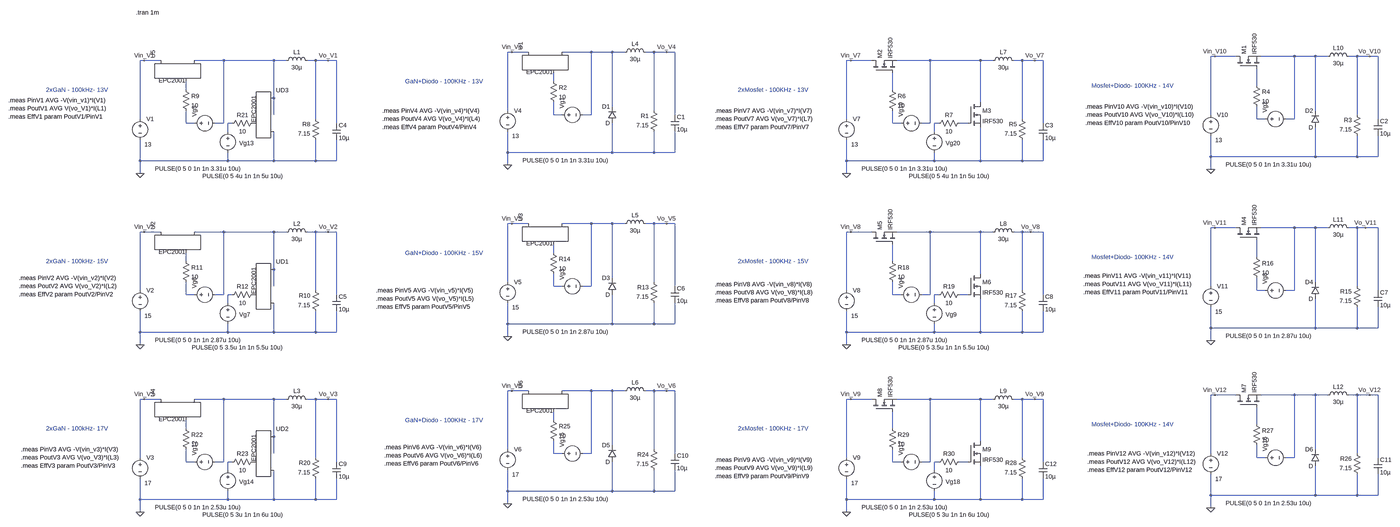
[diagram p0: schematic Variação Tensao.asc, whole sheet]
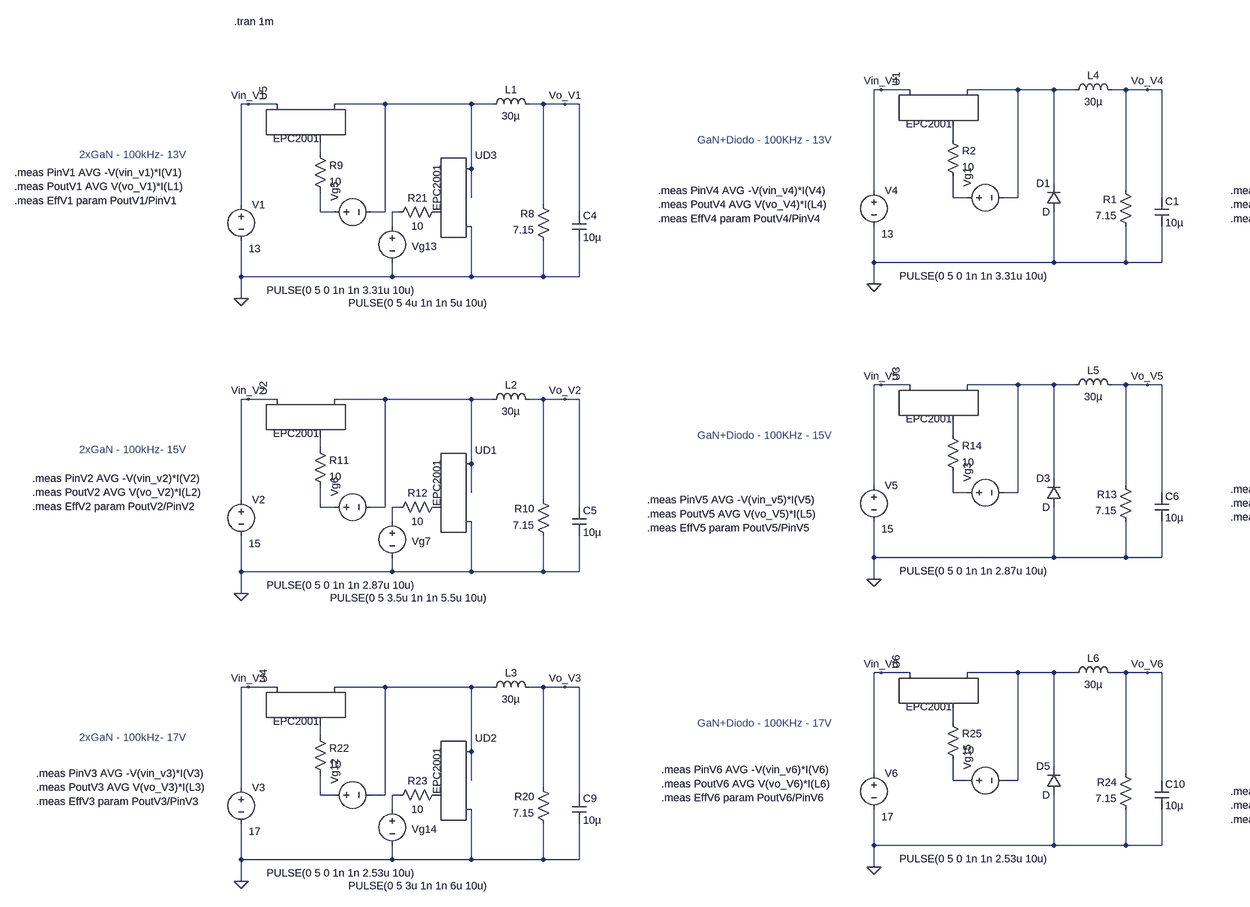
[diagram p1: schematic Variação Tensao.asc, part, row 1 of 1, column 1 of 2]
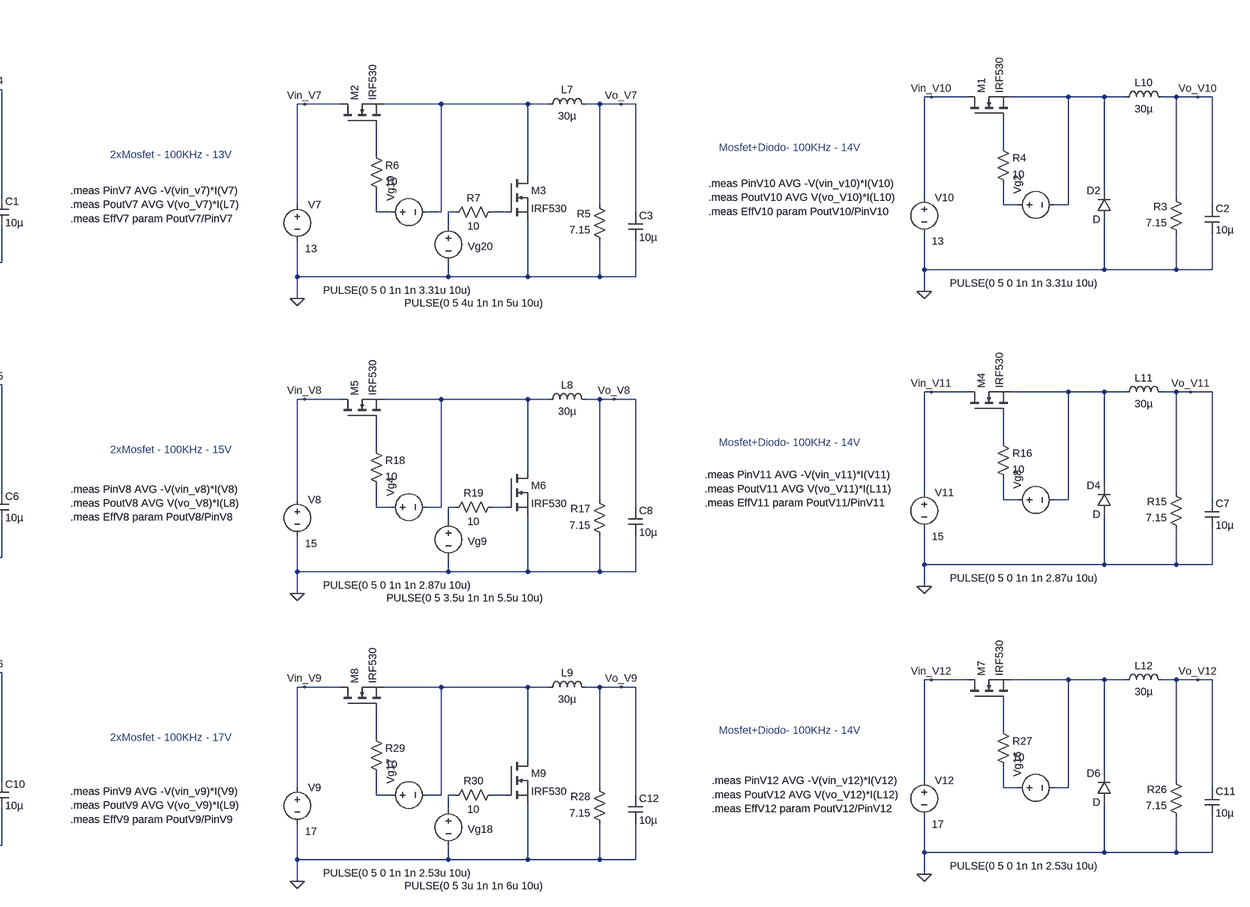
[diagram p2: schematic Variação Tensao.asc, part, row 1 of 1, column 2 of 2]
Variação Tensao.asc, the LTspice schematic file:
Version 4
SHEET 1 6056 2684
WIRE 2096 896 2080 896
WIRE 2160 896 2096 896
WIRE 2400 896 2288 896
WIRE 2480 896 2400 896
WIRE 2528 896 2480 896
WIRE 2640 896 2608 896
WIRE 2688 896 2640 896
WIRE 2720 896 2688 896
WIRE 5040 912 5024 912
WIRE 5120 912 5040 912
WIRE 5344 912 5216 912
WIRE 5424 912 5344 912
WIRE 5472 912 5424 912
WIRE 5584 912 5552 912
WIRE 5632 912 5584 912
WIRE 5664 912 5632 912
WIRE 656 928 640 928
WIRE 720 928 656 928
WIRE 960 928 848 928
WIRE 1152 928 960 928
WIRE 1200 928 1152 928
WIRE 1312 928 1280 928
WIRE 1360 928 1312 928
WIRE 1392 928 1360 928
WIRE 3488 928 3472 928
WIRE 3568 928 3488 928
WIRE 3792 928 3664 928
WIRE 3984 928 3792 928
WIRE 4032 928 3984 928
WIRE 4144 928 4112 928
WIRE 4192 928 4144 928
WIRE 4224 928 4192 928
WIRE 2256 1008 2256 976
WIRE 5200 1024 5200 960
WIRE 816 1040 816 1008
WIRE 3648 1040 3648 976
WIRE 1152 1072 1152 928
WIRE 3984 1088 3984 928
WIRE 2480 1104 2480 896
WIRE 2080 1120 2080 896
WIRE 2640 1120 2640 896
WIRE 5424 1120 5424 912
WIRE 1152 1136 1152 1072
WIRE 2256 1136 2256 1088
WIRE 2288 1136 2256 1136
WIRE 2400 1136 2400 896
WIRE 2400 1136 2368 1136
WIRE 2720 1136 2720 896
WIRE 5024 1136 5024 912
WIRE 5584 1136 5584 912
WIRE 640 1152 640 928
WIRE 1312 1152 1312 928
WIRE 3472 1152 3472 928
WIRE 4144 1152 4144 928
WIRE 5200 1152 5200 1104
WIRE 5232 1152 5200 1152
WIRE 5344 1152 5344 912
WIRE 5344 1152 5312 1152
WIRE 5664 1152 5664 912
WIRE 816 1168 816 1120
WIRE 848 1168 816 1168
WIRE 960 1168 960 928
WIRE 960 1168 928 1168
WIRE 992 1168 976 1168
WIRE 1392 1168 1392 928
WIRE 3648 1168 3648 1120
WIRE 3680 1168 3648 1168
WIRE 3792 1168 3792 928
WIRE 3792 1168 3760 1168
WIRE 3824 1168 3808 1168
WIRE 3936 1168 3904 1168
WIRE 4224 1168 4224 928
WIRE 976 1200 976 1168
WIRE 3808 1200 3808 1168
WIRE 2080 1280 2080 1200
WIRE 2480 1280 2480 1168
WIRE 2480 1280 2080 1280
WIRE 2640 1280 2640 1200
WIRE 2640 1280 2480 1280
WIRE 2720 1280 2720 1200
WIRE 2720 1280 2640 1280
WIRE 5024 1296 5024 1216
WIRE 5424 1296 5424 1184
WIRE 5424 1296 5024 1296
WIRE 5584 1296 5584 1216
WIRE 5584 1296 5424 1296
WIRE 5664 1296 5664 1216
WIRE 5664 1296 5584 1296
WIRE 640 1312 640 1232
WIRE 976 1312 976 1280
WIRE 976 1312 640 1312
WIRE 1152 1312 1152 1200
WIRE 1152 1312 976 1312
WIRE 1312 1312 1312 1232
WIRE 1312 1312 1152 1312
WIRE 1392 1312 1392 1232
WIRE 1392 1312 1312 1312
WIRE 3472 1312 3472 1232
WIRE 3808 1312 3808 1280
WIRE 3808 1312 3472 1312
WIRE 3984 1312 3984 1184
WIRE 3984 1312 3808 1312
WIRE 4144 1312 4144 1232
WIRE 4144 1312 3984 1312
WIRE 4224 1312 4224 1232
WIRE 4224 1312 4144 1312
WIRE 2080 1328 2080 1280
WIRE 5024 1344 5024 1296
WIRE 640 1360 640 1312
WIRE 3472 1360 3472 1312
WIRE 2096 1552 2080 1552
WIRE 2160 1552 2096 1552
WIRE 2400 1552 2288 1552
WIRE 2480 1552 2400 1552
WIRE 2528 1552 2480 1552
WIRE 2640 1552 2608 1552
WIRE 2688 1552 2640 1552
WIRE 2720 1552 2688 1552
WIRE 5040 1568 5024 1568
WIRE 5120 1568 5040 1568
WIRE 5344 1568 5216 1568
WIRE 5424 1568 5344 1568
WIRE 5472 1568 5424 1568
WIRE 5584 1568 5552 1568
WIRE 5616 1568 5584 1568
WIRE 5664 1568 5616 1568
WIRE 656 1584 640 1584
WIRE 720 1584 656 1584
WIRE 960 1584 848 1584
WIRE 1152 1584 960 1584
WIRE 1200 1584 1152 1584
WIRE 1312 1584 1280 1584
WIRE 1360 1584 1312 1584
WIRE 1392 1584 1360 1584
WIRE 3488 1584 3472 1584
WIRE 3568 1584 3488 1584
WIRE 3792 1584 3664 1584
WIRE 3984 1584 3792 1584
WIRE 4032 1584 3984 1584
WIRE 4144 1584 4112 1584
WIRE 4176 1584 4144 1584
WIRE 4224 1584 4176 1584
WIRE 2256 1664 2256 1632
WIRE 5200 1680 5200 1616
WIRE 816 1696 816 1664
WIRE 3648 1696 3648 1632
WIRE 1152 1728 1152 1584
WIRE 3984 1744 3984 1584
WIRE 2480 1760 2480 1552
WIRE 2080 1776 2080 1552
WIRE 2640 1776 2640 1552
WIRE 5424 1776 5424 1568
WIRE 1152 1792 1152 1728
WIRE 2256 1792 2256 1744
WIRE 2288 1792 2256 1792
WIRE 2400 1792 2400 1552
WIRE 2400 1792 2368 1792
WIRE 2720 1792 2720 1552
WIRE 5024 1792 5024 1568
WIRE 5584 1792 5584 1568
WIRE 640 1808 640 1584
WIRE 1312 1808 1312 1584
WIRE 3472 1808 3472 1584
WIRE 4144 1808 4144 1584
WIRE 5200 1808 5200 1760
WIRE 5232 1808 5200 1808
WIRE 5344 1808 5344 1568
WIRE 5344 1808 5312 1808
WIRE 5664 1808 5664 1568
WIRE 816 1824 816 1776
WIRE 848 1824 816 1824
WIRE 960 1824 960 1584
WIRE 960 1824 928 1824
WIRE 992 1824 976 1824
WIRE 1392 1824 1392 1584
WIRE 3648 1824 3648 1776
WIRE 3680 1824 3648 1824
WIRE 3792 1824 3792 1584
WIRE 3792 1824 3760 1824
WIRE 3824 1824 3808 1824
WIRE 3936 1824 3904 1824
WIRE 4224 1824 4224 1584
WIRE 976 1856 976 1824
WIRE 3808 1856 3808 1824
WIRE 2080 1936 2080 1856
WIRE 2480 1936 2480 1824
WIRE 2480 1936 2080 1936
WIRE 2640 1936 2640 1856
WIRE 2640 1936 2480 1936
WIRE 2720 1936 2720 1856
WIRE 2720 1936 2640 1936
WIRE 5024 1952 5024 1872
WIRE 5424 1952 5424 1840
WIRE 5424 1952 5024 1952
WIRE 5584 1952 5584 1872
WIRE 5584 1952 5424 1952
WIRE 5664 1952 5664 1872
WIRE 5664 1952 5584 1952
WIRE 640 1968 640 1888
WIRE 976 1968 976 1936
WIRE 976 1968 640 1968
WIRE 1152 1968 1152 1856
WIRE 1152 1968 976 1968
WIRE 1312 1968 1312 1888
WIRE 1312 1968 1152 1968
WIRE 1392 1968 1392 1888
WIRE 1392 1968 1312 1968
WIRE 3472 1968 3472 1888
WIRE 3808 1968 3808 1936
WIRE 3808 1968 3472 1968
WIRE 3984 1968 3984 1840
WIRE 3984 1968 3808 1968
WIRE 4144 1968 4144 1888
WIRE 4144 1968 3984 1968
WIRE 4224 1968 4224 1888
WIRE 4224 1968 4144 1968
WIRE 2080 1984 2080 1936
WIRE 5024 2000 5024 1952
WIRE 640 2016 640 1968
WIRE 3472 2016 3472 1968
WIRE 2096 2192 2080 2192
WIRE 2160 2192 2096 2192
WIRE 2400 2192 2288 2192
WIRE 2480 2192 2400 2192
WIRE 2528 2192 2480 2192
WIRE 2640 2192 2608 2192
WIRE 2688 2192 2640 2192
WIRE 2720 2192 2688 2192
WIRE 5040 2208 5024 2208
WIRE 5120 2208 5040 2208
WIRE 5344 2208 5216 2208
WIRE 5424 2208 5344 2208
WIRE 5472 2208 5424 2208
WIRE 5584 2208 5552 2208
WIRE 5632 2208 5584 2208
WIRE 5664 2208 5632 2208
WIRE 656 2224 640 2224
WIRE 720 2224 656 2224
WIRE 960 2224 848 2224
WIRE 1152 2224 960 2224
WIRE 1200 2224 1152 2224
WIRE 1312 2224 1280 2224
WIRE 1360 2224 1312 2224
WIRE 1392 2224 1360 2224
WIRE 3488 2224 3472 2224
WIRE 3568 2224 3488 2224
WIRE 3792 2224 3664 2224
WIRE 3984 2224 3792 2224
WIRE 4032 2224 3984 2224
WIRE 4144 2224 4112 2224
WIRE 4192 2224 4144 2224
WIRE 4224 2224 4192 2224
WIRE 2256 2304 2256 2272
WIRE 5200 2320 5200 2256
WIRE 816 2336 816 2304
WIRE 3648 2336 3648 2272
WIRE 1152 2368 1152 2224
WIRE 3984 2384 3984 2224
WIRE 2480 2400 2480 2192
WIRE 2080 2416 2080 2192
WIRE 2640 2416 2640 2192
WIRE 5424 2416 5424 2208
WIRE 1152 2432 1152 2368
WIRE 2256 2432 2256 2384
WIRE 2288 2432 2256 2432
WIRE 2400 2432 2400 2192
WIRE 2400 2432 2368 2432
WIRE 2720 2432 2720 2192
WIRE 5024 2432 5024 2208
WIRE 5584 2432 5584 2208
WIRE 640 2448 640 2224
WIRE 1312 2448 1312 2224
WIRE 3472 2448 3472 2224
WIRE 4144 2448 4144 2224
WIRE 5200 2448 5200 2400
WIRE 5232 2448 5200 2448
WIRE 5344 2448 5344 2208
WIRE 5344 2448 5312 2448
WIRE 5664 2448 5664 2208
WIRE 816 2464 816 2416
WIRE 848 2464 816 2464
WIRE 960 2464 960 2224
WIRE 960 2464 928 2464
WIRE 992 2464 976 2464
WIRE 1392 2464 1392 2224
WIRE 3648 2464 3648 2416
WIRE 3680 2464 3648 2464
WIRE 3792 2464 3792 2224
WIRE 3792 2464 3760 2464
WIRE 3824 2464 3808 2464
WIRE 3936 2464 3904 2464
WIRE 4224 2464 4224 2224
WIRE 976 2496 976 2464
WIRE 3808 2496 3808 2464
WIRE 2080 2576 2080 2496
WIRE 2480 2576 2480 2464
WIRE 2480 2576 2080 2576
WIRE 2640 2576 2640 2496
WIRE 2640 2576 2480 2576
WIRE 2720 2576 2720 2496
WIRE 2720 2576 2640 2576
WIRE 5024 2592 5024 2512
WIRE 5424 2592 5424 2480
WIRE 5424 2592 5024 2592
WIRE 5584 2592 5584 2512
WIRE 5584 2592 5424 2592
WIRE 5664 2592 5664 2512
WIRE 5664 2592 5584 2592
WIRE 640 2608 640 2528
WIRE 976 2608 976 2576
WIRE 976 2608 640 2608
WIRE 1152 2608 1152 2496
WIRE 1152 2608 976 2608
WIRE 1312 2608 1312 2528
WIRE 1312 2608 1152 2608
WIRE 1392 2608 1392 2528
WIRE 1392 2608 1312 2608
WIRE 3472 2608 3472 2528
WIRE 3808 2608 3808 2576
WIRE 3808 2608 3472 2608
WIRE 3984 2608 3984 2480
WIRE 3984 2608 3808 2608
WIRE 4144 2608 4144 2528
WIRE 4144 2608 3984 2608
WIRE 4224 2608 4224 2528
WIRE 4224 2608 4144 2608
WIRE 2080 2624 2080 2576
WIRE 5024 2640 5024 2592
WIRE 640 2656 640 2608
WIRE 3472 2656 3472 2608
FLAG 640 1360 0
FLAG 1360 928 Vo_V1
FLAG 656 928 Vin_V1
FLAG 2080 1328 0
FLAG 2096 896 Vin_V4
FLAG 5024 1344 0
FLAG 5040 912 Vin_V10
FLAG 3472 1360 0
FLAG 3488 928 Vin_V7
FLAG 640 2016 0
FLAG 1360 1584 Vo_V2
FLAG 656 1584 Vin_V2
FLAG 2080 1984 0
FLAG 2096 1552 Vin_V5
FLAG 5024 2000 0
FLAG 5040 1568 Vin_V11
FLAG 3472 2016 0
FLAG 3488 1584 Vin_V8
FLAG 640 2656 0
FLAG 1360 2224 Vo_V3
FLAG 656 2224 Vin_V3
FLAG 2080 2624 0
FLAG 2096 2192 Vin_V6
FLAG 5024 2640 0
FLAG 5040 2208 Vin_V12
FLAG 3472 2656 0
FLAG 3488 2224 Vin_V9
FLAG 2688 896 Vo_V4
FLAG 4192 928 Vo_V7
FLAG 5632 912 Vo_V10
FLAG 2688 1552 Vo_V5
FLAG 4176 1584 Vo_V8
FLAG 5616 1568 Vo_V11
FLAG 2688 2192 Vo_V6
FLAG 4192 2224 Vo_V9
FLAG 5632 2208 Vo_V12
SYMBOL voltage 832 1168 R270
WINDOW 3 -174 -135 VRight 2
WINDOW 123 0 0 Left 2
SYMATTR Value PULSE(0 5 0 1n 1n 3.31u 10u)
SYMATTR SpiceLine Rser=2
SYMATTR InstName Vg5
SYMBOL voltage 640 1136 R0
WINDOW 123 0 0 Left 2
WINDOW 3 17 113 Left 2
SYMATTR Value 13
SYMATTR SpiceLine Rser=0
SYMATTR InstName V1
SYMBOL EPCGaN 816 1008 R270
WINDOW 3 4 -105 VRight 2
SYMATTR Value EPC2001
SYMATTR InstName U5
SYMBOL ind 1184 944 R270
WINDOW 0 32 56 VTop 2
WINDOW 3 5 56 VBottom 2
SYMATTR InstName L1
SYMATTR Value 30µ
SYMBOL res 1328 1248 R180
WINDOW 0 36 76 Left 2
WINDOW 3 36 40 Left 2
SYMATTR InstName R8
SYMATTR Value 7.15
SYMBOL cap 1376 1168 R0
SYMATTR InstName C4
SYMATTR Value 10µ
SYMBOL res 800 1024 R0
SYMATTR InstName R9
SYMATTR Value 10
SYMBOL voltage 976 1184 R0
WINDOW 3 213 186 Right 2
WINDOW 123 0 0 Left 2
WINDOW 0 43 60 Left 2
SYMATTR Value PULSE(0 5 4u 1n 1n 5u 10u)
SYMATTR InstName Vg13
SYMATTR SpiceLine Rser=2
SYMBOL EPCGaN 1072 1168 R0
WINDOW 3 4 -105 VRight 2
SYMATTR Value EPC2001
SYMATTR InstName UD3
SYMBOL res 1088 1152 R90
WINDOW 0 0 56 VBottom 2
WINDOW 3 32 56 VTop 2
SYMATTR InstName R21
SYMATTR Value 10
SYMBOL voltage 2080 1104 R0
WINDOW 123 0 0 Left 2
WINDOW 3 17 113 Left 2
SYMATTR Value 13
SYMATTR SpiceLine Rser=0
SYMATTR InstName V4
SYMBOL EPCGaN 2256 976 R270
WINDOW 3 4 -105 VRight 2
SYMATTR Value EPC2001
SYMATTR InstName U1
SYMBOL diode 2496 1168 R180
WINDOW 0 24 64 Left 2
WINDOW 3 24 0 Left 2
SYMATTR InstName D1
SYMBOL res 2656 1216 R180
WINDOW 0 36 76 Left 2
WINDOW 3 36 40 Left 2
SYMATTR InstName R1
SYMATTR Value 7.15
SYMBOL cap 2704 1136 R0
SYMATTR InstName C1
SYMATTR Value 10µ
SYMBOL res 2240 992 R0
SYMATTR InstName R2
SYMATTR Value 10
SYMBOL voltage 5024 1120 R0
WINDOW 123 0 0 Left 2
WINDOW 3 17 113 Left 2
SYMATTR Value 13
SYMATTR SpiceLine Rser=0
SYMATTR InstName V10
SYMBOL diode 5440 1184 R180
WINDOW 0 24 64 Left 2
WINDOW 3 24 0 Left 2
SYMATTR InstName D2
SYMBOL res 5600 1232 R180
WINDOW 0 36 76 Left 2
WINDOW 3 36 40 Left 2
SYMATTR InstName R3
SYMATTR Value 7.15
SYMBOL cap 5648 1152 R0
SYMATTR InstName C2
SYMATTR Value 10µ
SYMBOL res 5184 1008 R0
SYMATTR InstName R4
SYMATTR Value 10
SYMBOL nmos 5120 960 R270
SYMATTR InstName M1
SYMATTR Value IRF530
SYMBOL voltage 3472 1136 R0
WINDOW 123 0 0 Left 2
WINDOW 3 17 113 Left 2
SYMATTR Value 13
SYMATTR SpiceLine Rser=0
SYMATTR InstName V7
SYMBOL res 4160 1248 R180
WINDOW 0 36 76 Left 2
WINDOW 3 36 40 Left 2
SYMATTR InstName R5
SYMATTR Value 7.15
SYMBOL cap 4208 1168 R0
SYMATTR InstName C3
SYMATTR Value 10µ
SYMBOL res 3632 1024 R0
SYMATTR InstName R6
SYMATTR Value 10
SYMBOL res 3920 1152 R90
WINDOW 0 0 56 VBottom 2
WINDOW 3 32 56 VTop 2
SYMATTR InstName R7
SYMATTR Value 10
SYMBOL nmos 3568 976 R270
SYMATTR InstName M2
SYMATTR Value IRF530
SYMBOL nmos 3936 1088 R0
SYMATTR InstName M3
SYMATTR Value IRF530
SYMBOL voltage 832 1824 R270
WINDOW 3 -174 -135 VRight 2
WINDOW 123 0 0 Left 2
SYMATTR Value PULSE(0 5 0 1n 1n 2.87u 10u)
SYMATTR SpiceLine Rser=2
SYMATTR InstName Vg6
SYMBOL voltage 640 1792 R0
WINDOW 123 0 0 Left 2
WINDOW 3 17 113 Left 2
SYMATTR Value 15
SYMATTR SpiceLine Rser=0
SYMATTR InstName V2
SYMBOL EPCGaN 816 1664 R270
WINDOW 3 4 -105 VRight 2
SYMATTR Value EPC2001
SYMATTR InstName U2
SYMBOL ind 1184 1600 R270
WINDOW 0 32 56 VTop 2
WINDOW 3 5 56 VBottom 2
SYMATTR InstName L2
SYMATTR Value 30µ
SYMBOL res 1328 1904 R180
WINDOW 0 36 76 Left 2
WINDOW 3 36 40 Left 2
SYMATTR InstName R10
SYMATTR Value 7.15
SYMBOL cap 1376 1824 R0
SYMATTR InstName C5
SYMATTR Value 10µ
SYMBOL res 800 1680 R0
SYMATTR InstName R11
SYMATTR Value 10
SYMBOL voltage 976 1840 R0
WINDOW 3 213 186 Right 2
WINDOW 123 0 0 Left 2
WINDOW 0 43 60 Left 2
SYMATTR Value PULSE(0 5 3.5u 1n 1n 5.5u 10u)
SYMATTR InstName Vg7
SYMATTR SpiceLine Rser=2
SYMBOL EPCGaN 1072 1824 R0
WINDOW 3 4 -105 VRight 2
SYMATTR Value EPC2001
SYMATTR InstName UD1
SYMBOL res 1088 1808 R90
WINDOW 0 0 56 VBottom 2
WINDOW 3 32 56 VTop 2
SYMATTR InstName R12
SYMATTR Value 10
SYMBOL voltage 2080 1760 R0
WINDOW 123 0 0 Left 2
WINDOW 3 17 113 Left 2
SYMATTR Value 15
SYMATTR SpiceLine Rser=0
SYMATTR InstName V5
SYMBOL EPCGaN 2256 1632 R270
WINDOW 3 4 -105 VRight 2
SYMATTR Value EPC2001
SYMATTR InstName U3
SYMBOL diode 2496 1824 R180
WINDOW 0 24 64 Left 2
WINDOW 3 24 0 Left 2
SYMATTR InstName D3
SYMBOL res 2656 1872 R180
WINDOW 0 36 76 Left 2
WINDOW 3 36 40 Left 2
SYMATTR InstName R13
SYMATTR Value 7.15
SYMBOL cap 2704 1792 R0
SYMATTR InstName C6
SYMATTR Value 10µ
SYMBOL res 2240 1648 R0
SYMATTR InstName R14
SYMATTR Value 10
SYMBOL voltage 5024 1776 R0
WINDOW 123 0 0 Left 2
WINDOW 3 17 113 Left 2
SYMATTR Value 15
SYMATTR SpiceLine Rser=0
SYMATTR InstName V11
SYMBOL diode 5440 1840 R180
WINDOW 0 24 64 Left 2
WINDOW 3 24 0 Left 2
SYMATTR InstName D4
SYMBOL res 5600 1888 R180
WINDOW 0 36 76 Left 2
WINDOW 3 36 40 Left 2
SYMATTR InstName R15
SYMATTR Value 7.15
SYMBOL cap 5648 1808 R0
SYMATTR InstName C7
SYMATTR Value 10µ
SYMBOL res 5184 1664 R0
SYMATTR InstName R16
SYMATTR Value 10
SYMBOL nmos 5120 1616 R270
SYMATTR InstName M4
SYMATTR Value IRF530
SYMBOL voltage 3472 1792 R0
WINDOW 123 0 0 Left 2
WINDOW 3 17 113 Left 2
SYMATTR Value 15
SYMATTR SpiceLine Rser=0
SYMATTR InstName V8
SYMBOL res 4160 1904 R180
WINDOW 0 36 76 Left 2
WINDOW 3 36 40 Left 2
SYMATTR InstName R17
SYMATTR Value 7.15
SYMBOL cap 4208 1824 R0
SYMATTR InstName C8
SYMATTR Value 10µ
SYMBOL res 3632 1680 R0
SYMATTR InstName R18
SYMATTR Value 10
SYMBOL res 3920 1808 R90
WINDOW 0 0 56 VBottom 2
WINDOW 3 32 56 VTop 2
SYMATTR InstName R19
SYMATTR Value 10
SYMBOL nmos 3568 1632 R270
SYMATTR InstName M5
SYMATTR Value IRF530
SYMBOL nmos 3936 1744 R0
SYMATTR InstName M6
SYMATTR Value IRF530
SYMBOL voltage 832 2464 R270
WINDOW 3 -174 -135 VRight 2
WINDOW 123 0 0 Left 2
SYMATTR Value PULSE(0 5 0 1n 1n 2.53u 10u)
SYMATTR SpiceLine Rser=2
SYMATTR InstName Vg12
SYMBOL voltage 640 2432 R0
WINDOW 123 0 0 Left 2
WINDOW 3 17 113 Left 2
SYMATTR Value 17
SYMATTR SpiceLine Rser=0
SYMATTR InstName V3
SYMBOL EPCGaN 816 2304 R270
WINDOW 3 4 -105 VRight 2
SYMATTR Value EPC2001
SYMATTR InstName U4
SYMBOL ind 1184 2240 R270
WINDOW 0 32 56 VTop 2
WINDOW 3 5 56 VBottom 2
SYMATTR InstName L3
SYMATTR Value 30µ
SYMBOL res 1328 2544 R180
WINDOW 0 36 76 Left 2
WINDOW 3 36 40 Left 2
SYMATTR InstName R20
SYMATTR Value 7.15
SYMBOL cap 1376 2464 R0
SYMATTR InstName C9
SYMATTR Value 10µ
SYMBOL res 800 2320 R0
SYMATTR InstName R22
SYMATTR Value 10
SYMBOL voltage 976 2480 R0
WINDOW 3 213 186 Right 2
WINDOW 123 0 0 Left 2
WINDOW 0 43 60 Left 2
SYMATTR Value PULSE(0 5 3u 1n 1n 6u 10u)
SYMATTR InstName Vg14
SYMATTR SpiceLine Rser=2
SYMBOL EPCGaN 1072 2464 R0
WINDOW 3 4 -105 VRight 2
SYMATTR Value EPC2001
SYMATTR InstName UD2
SYMBOL res 1088 2448 R90
WINDOW 0 0 56 VBottom 2
WINDOW 3 32 56 VTop 2
SYMATTR InstName R23
SYMATTR Value 10
SYMBOL voltage 2272 2432 R270
WINDOW 3 -174 -135 VRight 2
WINDOW 123 0 0 Left 2
SYMATTR Value PULSE(0 5 0 1n 1n 2.53u 10u)
SYMATTR SpiceLine Rser=2
SYMATTR InstName Vg15
SYMBOL voltage 2080 2400 R0
WINDOW 123 0 0 Left 2
WINDOW 3 17 113 Left 2
SYMATTR Value 17
SYMATTR SpiceLine Rser=0
SYMATTR InstName V6
SYMBOL EPCGaN 2256 2272 R270
WINDOW 3 4 -105 VRight 2
SYMATTR Value EPC2001
SYMATTR InstName U6
SYMBOL diode 2496 2464 R180
WINDOW 0 24 64 Left 2
WINDOW 3 24 0 Left 2
SYMATTR InstName D5
SYMBOL res 2656 2512 R180
WINDOW 0 36 76 Left 2
WINDOW 3 36 40 Left 2
SYMATTR InstName R24
SYMATTR Value 7.15
SYMBOL cap 2704 2432 R0
SYMATTR InstName C10
SYMATTR Value 10µ
SYMBOL res 2240 2288 R0
SYMATTR InstName R25
SYMATTR Value 10
SYMBOL voltage 5216 2448 R270
WINDOW 3 -174 -135 VRight 2
WINDOW 123 0 0 Left 2
SYMATTR Value PULSE(0 5 0 1n 1n 2.53u 10u)
SYMATTR SpiceLine Rser=2
SYMATTR InstName Vg16
SYMBOL voltage 5024 2416 R0
WINDOW 123 0 0 Left 2
WINDOW 3 17 113 Left 2
SYMATTR Value 17
SYMATTR SpiceLine Rser=0
SYMATTR InstName V12
SYMBOL diode 5440 2480 R180
WINDOW 0 24 64 Left 2
WINDOW 3 24 0 Left 2
SYMATTR InstName D6
SYMBOL res 5600 2528 R180
WINDOW 0 36 76 Left 2
WINDOW 3 36 40 Left 2
SYMATTR InstName R26
SYMATTR Value 7.15
SYMBOL cap 5648 2448 R0
SYMATTR InstName C11
SYMATTR Value 10µ
SYMBOL res 5184 2304 R0
SYMATTR InstName R27
SYMATTR Value 10
SYMBOL nmos 5120 2256 R270
SYMATTR InstName M7
SYMATTR Value IRF530
SYMBOL voltage 3664 2464 R270
WINDOW 3 -174 -135 VRight 2
WINDOW 123 0 0 Left 2
SYMATTR Value PULSE(0 5 0 1n 1n 2.53u 10u)
SYMATTR SpiceLine Rser=2
SYMATTR InstName Vg17
SYMBOL voltage 3472 2432 R0
WINDOW 123 0 0 Left 2
WINDOW 3 17 113 Left 2
SYMATTR Value 17
SYMATTR SpiceLine Rser=0
SYMATTR InstName V9
SYMBOL res 4160 2544 R180
WINDOW 0 36 76 Left 2
WINDOW 3 36 40 Left 2
SYMATTR InstName R28
SYMATTR Value 7.15
SYMBOL cap 4208 2464 R0
SYMATTR InstName C12
SYMATTR Value 10µ
SYMBOL res 3632 2320 R0
SYMATTR InstName R29
SYMATTR Value 10
SYMBOL voltage 3808 2480 R0
WINDOW 3 213 186 Right 2
WINDOW 123 0 0 Left 2
WINDOW 0 43 60 Left 2
SYMATTR Value PULSE(0 5 3u 1n 1n 6u 10u)
SYMATTR InstName Vg18
SYMATTR SpiceLine Rser=2
SYMBOL res 3920 2448 R90
WINDOW 0 0 56 VBottom 2
WINDOW 3 32 56 VTop 2
SYMATTR InstName R30
SYMATTR Value 10
SYMBOL nmos 3568 2272 R270
SYMATTR InstName M8
SYMATTR Value IRF530
SYMBOL nmos 3936 2384 R0
SYMATTR InstName M9
SYMATTR Value IRF530
SYMBOL voltage 3664 1168 R270
WINDOW 3 -174 -135 VRight 2
WINDOW 123 0 0 Left 2
SYMATTR Value PULSE(0 5 0 1n 1n 3.31u 10u)
SYMATTR SpiceLine Rser=2
SYMATTR InstName Vg19
SYMBOL voltage 3808 1184 R0
WINDOW 3 213 186 Right 2
WINDOW 123 0 0 Left 2
WINDOW 0 43 60 Left 2
SYMATTR Value PULSE(0 5 4u 1n 1n 5u 10u)
SYMATTR InstName Vg20
SYMATTR SpiceLine Rser=2
SYMBOL voltage 2272 1136 R270
WINDOW 3 -174 -135 VRight 2
WINDOW 123 0 0 Left 2
SYMATTR Value PULSE(0 5 0 1n 1n 3.31u 10u)
SYMATTR SpiceLine Rser=2
SYMATTR InstName Vg1
SYMBOL voltage 5216 1152 R270
WINDOW 3 -174 -135 VRight 2
WINDOW 123 0 0 Left 2
SYMATTR Value PULSE(0 5 0 1n 1n 3.31u 10u)
SYMATTR SpiceLine Rser=2
SYMATTR InstName Vg2
SYMBOL voltage 2272 1792 R270
WINDOW 3 -174 -135 VRight 2
WINDOW 123 0 0 Left 2
SYMATTR Value PULSE(0 5 0 1n 1n 2.87u 10u)
SYMATTR SpiceLine Rser=2
SYMATTR InstName Vg3
SYMBOL voltage 3664 1824 R270
WINDOW 3 -174 -135 VRight 2
WINDOW 123 0 0 Left 2
SYMATTR Value PULSE(0 5 0 1n 1n 2.87u 10u)
SYMATTR SpiceLine Rser=2
SYMATTR InstName Vg4
SYMBOL voltage 5216 1808 R270
WINDOW 3 -174 -135 VRight 2
WINDOW 123 0 0 Left 2
SYMATTR Value PULSE(0 5 0 1n 1n 2.87u 10u)
SYMATTR SpiceLine Rser=2
SYMATTR InstName Vg8
SYMBOL voltage 3808 1840 R0
WINDOW 3 213 186 Right 2
WINDOW 123 0 0 Left 2
WINDOW 0 43 60 Left 2
SYMATTR Value PULSE(0 5 3.5u 1n 1n 5.5u 10u)
SYMATTR InstName Vg9
SYMATTR SpiceLine Rser=2
SYMBOL ind 2512 912 R270
WINDOW 0 32 56 VTop 2
WINDOW 3 5 56 VBottom 2
SYMATTR InstName L4
SYMATTR Value 30µ
SYMBOL ind 2512 1568 R270
WINDOW 0 32 56 VTop 2
WINDOW 3 5 56 VBottom 2
SYMATTR InstName L5
SYMATTR Value 30µ
SYMBOL ind 2512 2208 R270
WINDOW 0 32 56 VTop 2
WINDOW 3 5 56 VBottom 2
SYMATTR InstName L6
SYMATTR Value 30µ
SYMBOL ind 4016 944 R270
WINDOW 0 32 56 VTop 2
WINDOW 3 5 56 VBottom 2
SYMATTR InstName L7
SYMATTR Value 30µ
SYMBOL ind 4016 1600 R270
WINDOW 0 32 56 VTop 2
WINDOW 3 5 56 VBottom 2
SYMATTR InstName L8
SYMATTR Value 30µ
SYMBOL ind 4016 2240 R270
WINDOW 0 32 56 VTop 2
WINDOW 3 5 56 VBottom 2
SYMATTR InstName L9
SYMATTR Value 30µ
SYMBOL ind 5456 928 R270
WINDOW 0 32 56 VTop 2
WINDOW 3 5 56 VBottom 2
SYMATTR InstName L10
SYMATTR Value 30µ
SYMBOL ind 5456 1584 R270
WINDOW 0 32 56 VTop 2
WINDOW 3 5 56 VBottom 2
SYMATTR InstName L11
SYMATTR Value 30µ
SYMBOL ind 5456 2224 R270
WINDOW 0 32 56 VTop 2
WINDOW 3 5 56 VBottom 2
SYMATTR InstName L12
SYMATTR Value 30µ
TEXT 624 744 Left 2 !.tran 1m
TEXT 280 1040 Left 2 ;2xGaN - 100kHz- 13V
TEXT 136 1080 Left 2 !.meas PinV1 AVG -V(vin_v1)*I(V1)\n.meas PoutV1 AVG V(vo_V1)*I(L1)\n.meas EffV1 param PoutV1/PinV1
TEXT 1688 1008 Left 2 ;GaN+Diodo - 100KHz - 13V
TEXT 4568 1024 Left 2 ;Mosfet+Diodo- 100KHz - 14V
TEXT 3056 1040 Left 2 ;2xMosfet - 100KHz - 13V
TEXT 280 1696 Left 2 ;2xGaN - 100kHz- 15V
TEXT 1688 1664 Left 2 ;GaN+Diodo - 100KHz - 15V
TEXT 4568 1680 Left 2 ;Mosfet+Diodo- 100KHz - 14V
TEXT 3056 1696 Left 2 ;2xMosfet - 100KHz - 15V
TEXT 280 2336 Left 2 ;2xGaN - 100kHz- 17V
TEXT 1688 2304 Left 2 ;GaN+Diodo - 100KHz - 17V
TEXT 4568 2320 Left 2 ;Mosfet+Diodo- 100KHz - 14V
TEXT 3056 2336 Left 2 ;2xMosfet - 100KHz - 17V
TEXT 176 1760 Left 2 !.meas PinV2 AVG -V(vin_v2)*I(V2)\n.meas PoutV2 AVG V(vo_V2)*I(L2)\n.meas EffV2 param PoutV2/PinV2
TEXT 184 2416 Left 2 !.meas PinV3 AVG -V(vin_v3)*I(V3)\n.meas PoutV3 AVG V(vo_V3)*I(L3)\n.meas EffV3 param PoutV3/PinV3
TEXT 1600 1120 Left 2 !.meas PinV4 AVG -V(vin_v4)*I(V4)\n.meas PoutV4 AVG V(vo_V4)*I(L4)\n.meas EffV4 param PoutV4/PinV4
TEXT 1576 1808 Left 2 !.meas PinV5 AVG -V(vin_v5)*I(V5)\n.meas PoutV5 AVG V(vo_V5)*I(L5)\n.meas EffV5 param PoutV5/PinV5
TEXT 1608 2408 Left 2 !.meas PinV6 AVG -V(vin_v6)*I(V6)\n.meas PoutV6 AVG V(vo_V6)*I(L6)\n.meas EffV6 param PoutV6/PinV6
TEXT 2968 2456 Left 2 !.meas PinV9 AVG -V(vin_v9)*I(V9)\n.meas PoutV9 AVG V(vo_V9)*I(L9)\n.meas EffV9 param PoutV9/PinV9
TEXT 2968 1784 Left 2 !.meas PinV8 AVG -V(vin_v8)*I(V8)\n.meas PoutV8 AVG V(vo_V8)*I(L8)\n.meas EffV8 param PoutV8/PinV8
TEXT 2968 1120 Left 2 !.meas PinV7 AVG -V(vin_v7)*I(V7)\n.meas PoutV7 AVG V(vo_V7)*I(L7)\n.meas EffV7 param PoutV7/PinV7
TEXT 4544 1104 Left 2 !.meas PinV10 AVG -V(vin_v10)*I(V10)\n.meas PoutV10 AVG V(vo_V10)*I(L10)\n.meas EffV10 param PoutV10/PinV10
TEXT 4536 1752 Left 2 !.meas PinV11 AVG -V(vin_v11)*I(V11)\n.meas PoutV11 AVG V(vo_V11)*I(L11)\n.meas EffV11 param PoutV11/PinV11
TEXT 4552 2432 Left 2 !.meas PinV12 AVG -V(vin_v12)*I(V12)\n.meas PoutV12 AVG V(vo_V12)*I(L12)\n.meas EffV12 param PoutV12/PinV12

The netlist it stands for:
* Variação Tensao.asc
Vg5 N011 N003 PULSE(0 5 0 1n 1n 3.31u 10u) Rser=2
V1 Vin_V1 0 13 Rser=0
XU5 N007 Vin_V1 N003 EPC2001
L1 N003 Vo_V1 30µ
R8 0 Vo_V1 7.15
C4 Vo_V1 0 10µ
R9 N007 N011 10
Vg13 N012 0 PULSE(0 5 4u 1n 1n 5u 10u) Rser=2
XUD3 P001 N003 0 EPC2001
R21 P001 N012 10
V4 Vin_V4 0 13 Rser=0
XU1 N005 Vin_V4 N001 EPC2001
D1 0 N001 D
R1 0 Vo_V4 7.15
C1 Vo_V4 0 10µ
R2 N005 N009 10
V10 Vin_V10 0 13 Rser=0
D2 0 N002 D
R3 0 Vo_V10 7.15
C2 Vo_V10 0 10µ
R4 N006 N010 10
M1 Vin_V10 N006 N002 N002 IRF530
V7 Vin_V7 0 13 Rser=0
R5 0 Vo_V7 7.15
C3 Vo_V7 0 10µ
R6 N008 N013 10
R7 N015 N014 10
M2 Vin_V7 N008 N004 N004 IRF530
M3 N004 N015 0 0 IRF530
Vg6 N026 N018 PULSE(0 5 0 1n 1n 2.87u 10u) Rser=2
V2 Vin_V2 0 15 Rser=0
XU2 N022 Vin_V2 N018 EPC2001
L2 N018 Vo_V2 30µ
R10 0 Vo_V2 7.15
C5 Vo_V2 0 10µ
R11 N022 N026 10
Vg7 N027 0 PULSE(0 5 3.5u 1n 1n 5.5u 10u) Rser=2
XUD1 P002 N018 0 EPC2001
R12 P002 N027 10
V5 Vin_V5 0 15 Rser=0
XU3 N020 Vin_V5 N016 EPC2001
D3 0 N016 D
R13 0 Vo_V5 7.15
C6 Vo_V5 0 10µ
R14 N020 N024 10
V11 Vin_V11 0 15 Rser=0
D4 0 N017 D
R15 0 Vo_V11 7.15
C7 Vo_V11 0 10µ
R16 N021 N025 10
M4 Vin_V11 N021 N017 N017 IRF530
V8 Vin_V8 0 15 Rser=0
R17 0 Vo_V8 7.15
C8 Vo_V8 0 10µ
R18 N023 N028 10
R19 N030 N029 10
M5 Vin_V8 N023 N019 N019 IRF530
M6 N019 N030 0 0 IRF530
Vg12 N041 N033 PULSE(0 5 0 1n 1n 2.53u 10u) Rser=2
V3 Vin_V3 0 17 Rser=0
XU4 N037 Vin_V3 N033 EPC2001
L3 N033 Vo_V3 30µ
R20 0 Vo_V3 7.15
C9 Vo_V3 0 10µ
R22 N037 N041 10
Vg14 N042 0 PULSE(0 5 3u 1n 1n 6u 10u) Rser=2
XUD2 P003 N033 0 EPC2001
R23 P003 N042 10
Vg15 N039 N031 PULSE(0 5 0 1n 1n 2.53u 10u) Rser=2
V6 Vin_V6 0 17 Rser=0
XU6 N035 Vin_V6 N031 EPC2001
D5 0 N031 D
R24 0 Vo_V6 7.15
C10 Vo_V6 0 10µ
R25 N035 N039 10
Vg16 N040 N032 PULSE(0 5 0 1n 1n 2.53u 10u) Rser=2
V12 Vin_V12 0 17 Rser=0
D6 0 N032 D
R26 0 Vo_V12 7.15
C11 Vo_V12 0 10µ
R27 N036 N040 10
M7 Vin_V12 N036 N032 N032 IRF530
Vg17 N043 N034 PULSE(0 5 0 1n 1n 2.53u 10u) Rser=2
V9 Vin_V9 0 17 Rser=0
R28 0 Vo_V9 7.15
C12 Vo_V9 0 10µ
R29 N038 N043 10
Vg18 N044 0 PULSE(0 5 3u 1n 1n 6u 10u) Rser=2
R30 N045 N044 10
M8 Vin_V9 N038 N034 N034 IRF530
M9 N034 N045 0 0 IRF530
Vg19 N013 N004 PULSE(0 5 0 1n 1n 3.31u 10u) Rser=2
Vg20 N014 0 PULSE(0 5 4u 1n 1n 5u 10u) Rser=2
Vg1 N009 N001 PULSE(0 5 0 1n 1n 3.31u 10u) Rser=2
Vg2 N010 N002 PULSE(0 5 0 1n 1n 3.31u 10u) Rser=2
Vg3 N024 N016 PULSE(0 5 0 1n 1n 2.87u 10u) Rser=2
Vg4 N028 N019 PULSE(0 5 0 1n 1n 2.87u 10u) Rser=2
Vg8 N025 N017 PULSE(0 5 0 1n 1n 2.87u 10u) Rser=2
Vg9 N029 0 PULSE(0 5 3.5u 1n 1n 5.5u 10u) Rser=2
L4 N001 Vo_V4 30µ
L5 N016 Vo_V5 30µ
L6 N031 Vo_V6 30µ
L7 N004 Vo_V7 30µ
L8 N019 Vo_V8 30µ
L9 N034 Vo_V9 30µ
L10 N002 Vo_V10 30µ
L11 N017 Vo_V11 30µ
L12 N032 Vo_V12 30µ
.model D D
.lib standard.dio
.model NMOS NMOS
.model PMOS PMOS
.lib standard.mos
.tran 1m
* 2xGaN - 100kHz- 13V
.meas PinV1 AVG -V(vin_v1)*I(V1)
.meas PoutV1 AVG V(vo_V1)*I(L1)
.meas EffV1 param PoutV1/PinV1
* GaN+Diodo - 100KHz - 13V
* Mosfet+Diodo- 100KHz - 14V
* 2xMosfet - 100KHz - 13V
* 2xGaN - 100kHz- 15V
* GaN+Diodo - 100KHz - 15V
* Mosfet+Diodo- 100KHz - 14V
* 2xMosfet - 100KHz - 15V
* 2xGaN - 100kHz- 17V
* GaN+Diodo - 100KHz - 17V
* Mosfet+Diodo- 100KHz - 14V
* 2xMosfet - 100KHz - 17V
.meas PinV2 AVG -V(vin_v2)*I(V2)
.meas PoutV2 AVG V(vo_V2)*I(L2)
.meas EffV2 param PoutV2/PinV2
.meas PinV3 AVG -V(vin_v3)*I(V3)
.meas PoutV3 AVG V(vo_V3)*I(L3)
.meas EffV3 param PoutV3/PinV3
.meas PinV4 AVG -V(vin_v4)*I(V4)
.meas PoutV4 AVG V(vo_V4)*I(L4)
.meas EffV4 param PoutV4/PinV4
.meas PinV5 AVG -V(vin_v5)*I(V5)
.meas PoutV5 AVG V(vo_V5)*I(L5)
.meas EffV5 param PoutV5/PinV5
.meas PinV6 AVG -V(vin_v6)*I(V6)
.meas PoutV6 AVG V(vo_V6)*I(L6)
.meas EffV6 param PoutV6/PinV6
.meas PinV9 AVG -V(vin_v9)*I(V9)
.meas PoutV9 AVG V(vo_V9)*I(L9)
.meas EffV9 param PoutV9/PinV9
.meas PinV8 AVG -V(vin_v8)*I(V8)
.meas PoutV8 AVG V(vo_V8)*I(L8)
.meas EffV8 param PoutV8/PinV8
.meas PinV7 AVG -V(vin_v7)*I(V7)
.meas PoutV7 AVG V(vo_V7)*I(L7)
.meas EffV7 param PoutV7/PinV7
.meas PinV10 AVG -V(vin_v10)*I(V10)
.meas PoutV10 AVG V(vo_V10)*I(L10)
.meas EffV10 param PoutV10/PinV10
.meas PinV11 AVG -V(vin_v11)*I(V11)
.meas PoutV11 AVG V(vo_V11)*I(L11)
.meas EffV11 param PoutV11/PinV11
.meas PinV12 AVG -V(vin_v12)*I(V12)
.meas PoutV12 AVG V(vo_V12)*I(L12)
.meas EffV12 param PoutV12/PinV12
.backanno
.end